# Altium schematic sheet TLE5012_V1.2.SchDoc
size A4
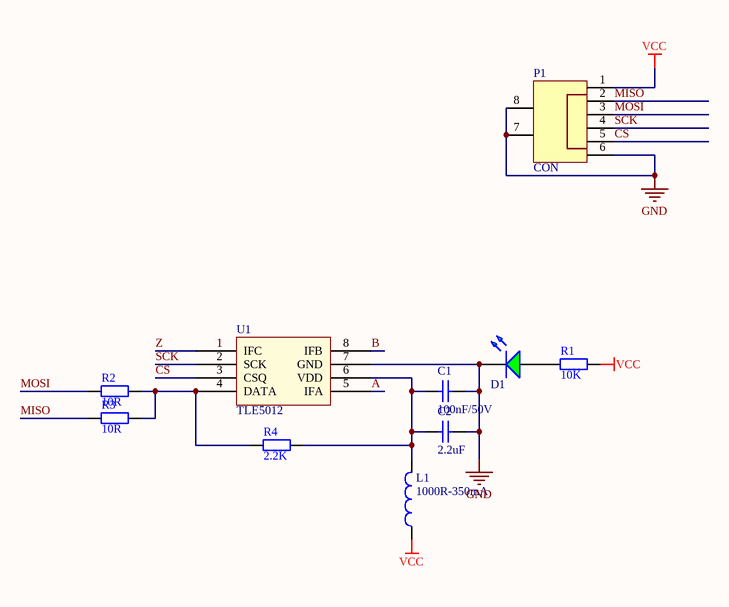
[diagram p0: TLE5012_V1.2.SchDoc]

## Parts
C1  100nF/50V  [0402_C]
C2  2.2uF  [0402_C]
D1  0603_D-CL-0603 URC-RED  [0603_D]  (value not drawn)
L1  1000R-350mA  [0402_L]
P1  CON  [BM06B-GHS-TBT(TOP)]
R1  10K  [0402_R]
R2  10R  [0402_R]
R3  10R  [0402_R]
R4  2.2K  [0402_R]
U1  TLE5012  [SOP-8]

## Nets
GND: C1.2 C2.2 D1.2(K) P1.6 P1.7 P1.8 U1.7(GND)
VCC: L1.1 P1.1 R1.2
A: U1.5(IFA)
B: U1.8(IFB)
CS: P1.5 U1.3(CSQ)
MISO: P1.2 R3.1
MOSI: P1.3 R2.1
SCK: P1.4 U1.2(SCK)
Z: U1.1(IFC)
NetC1_1: C1.1 C2.1 L1.2 R4.2 U1.6(VDD)
NetD1_1: D1.1(A) R1.1
NetR2_2: R2.2 R3.2 R4.1 U1.4(DATA)

## Library data of the parts
C1 C2 = Cap: Capacitor; Value: 100nF; Published: 8-Jun-2000; LatestRevisionDate: 17-Jul-2002; LatestRevisionNote: Re-released for DXP Platform.; PackageReference: RAD-0.3; Publisher: Altium Limited
D1 = LED: value: BH-27-21/R6C-AP1Q2B/3C
L1 = Inductor: Code_IEC: 1005; Value: BLM15AX102SN1; Published: 8-Jun-2000; LatestRevisionDate: 17-Jul-2002; LatestRevisionNote: Re-released for DXP Platform.; PackageReference: 0402-A; Publisher: Altium Limited; Code_JEITA: 0402
P1 = CON-6
R1-R4 = Res2: Resistor; Value: 1K; Published: 8-Jun-2000; LatestRevisionDate: 17-Jul-2002; LatestRevisionNote: Re-released for DXP Platform.; PackageReference: AXIAL-0.4; Publisher: Altium Limited